# Altium schematic sheet Buck_Converter.SchDoc
size A; SheetNumber: 3; SheetTotal: 7
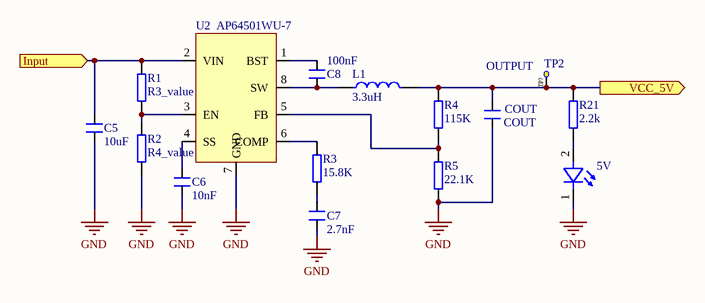
[diagram p0: Buck_Converter.SchDoc]

## Parts
5V  led  [LED_fp]  (value not drawn)
C5  10uF  [CAP_0805]
C6  10nF  [CAP_0805]
C7  2.7nF  [CAP_0805]
C8  100nF  [CAP_0805]
COUT  COUT  [CAP_0805]
L1  3.3uH  [SRN6045TA330M]
R1  R3_value  [RES0402]
R2  R4_value  [RES0402]
R3  15.8K  [RES0402]
R4  115K  [RES0402]
R5  22.1K  [RES0402]
R21  2.2k  [RES0402]
TP2  test_point  [Test_point]  (value not drawn)
U2  AP64501WU-7  [AP60501]

## Ports
Input (in, see schematic[2A]), VCC_5V (out, see schematic[3A], CAN_controller_trancs[2C])

## Nets
GND: 5V.1 C5.1 C6.1 C7.1 COUT.1 R2.1 R5.1 U2.7(GND)
Input: C5.2 R1.2 U2.2(VIN) ; port Input
VCC_5V: COUT.2 L1.2 R4.2 R21.2 TP2.TP?(Test_Point) ; port VCC_5V
Net5V_2: 5V.2 R21.1
NetC6_2: C6.2 U2.4(SS)
NetC7_2: C7.2 R3.1
NetC8_1: C8.1 L1.1 U2.8(SW)
NetC8_2: C8.2 U2.1(BST)
NetR1_1: R1.1 R2.2 U2.3(EN)
NetR3_2: R3.2 U2.6(COMP)
NetR4_1: R4.1 R5.2 U2.5(FB)

## Notes on the sheet
- OUTPUT

## Library data of the parts
5V = led: https://ro.farnell.com/wurth-elektronik/150080gs75000/led-0805-green-450mcd-520nm/dp/2322076?gross_price=true&CMP=KNC-GRO-GEN-SHOPPING-PMax_Test_840_MediumMargin&mckv=_dc%7Cpcrid%7C%7Cplid%7C%7Ckword%7C%7Cmatch%7C%7Cslid%7C%7Cproduct%7C2322076%7Cpgrid%7C%7Cptaid%7C%7C&gad_source=1&gclid=Cj0KCQjwjLGyBhCYARIsAPqTz18Amj4u5qMw452dzp4QFbvRWjaA25yZdq1iP5S9VaglDibMucql-VwaApB3EALw_wcB
C5-C8 COUT = CAP_0805
L1 = Inductor: SRN6045TA-3R3Y
R1-R5 R21 = RES 0402
U2 = AP64501WU-7: Manufacturer: Diodes; Manufacturer Part Number: AP64060WU-7; Supplier: Digikey; Supplier Part Number: 31-AP64060WU-7CT-ND; RoHS: No; Category: Voltage Regulators - Switching; Stock: 6070; Pricing: 1=0.62, 10=0.531, 25=0.496, 100=0.3968, 250=0.36844, 500=0.31174, 1000=0.2409 (USD)